# EasyEDA Pro project 15P1D_EDA.eprj, board PCB_1
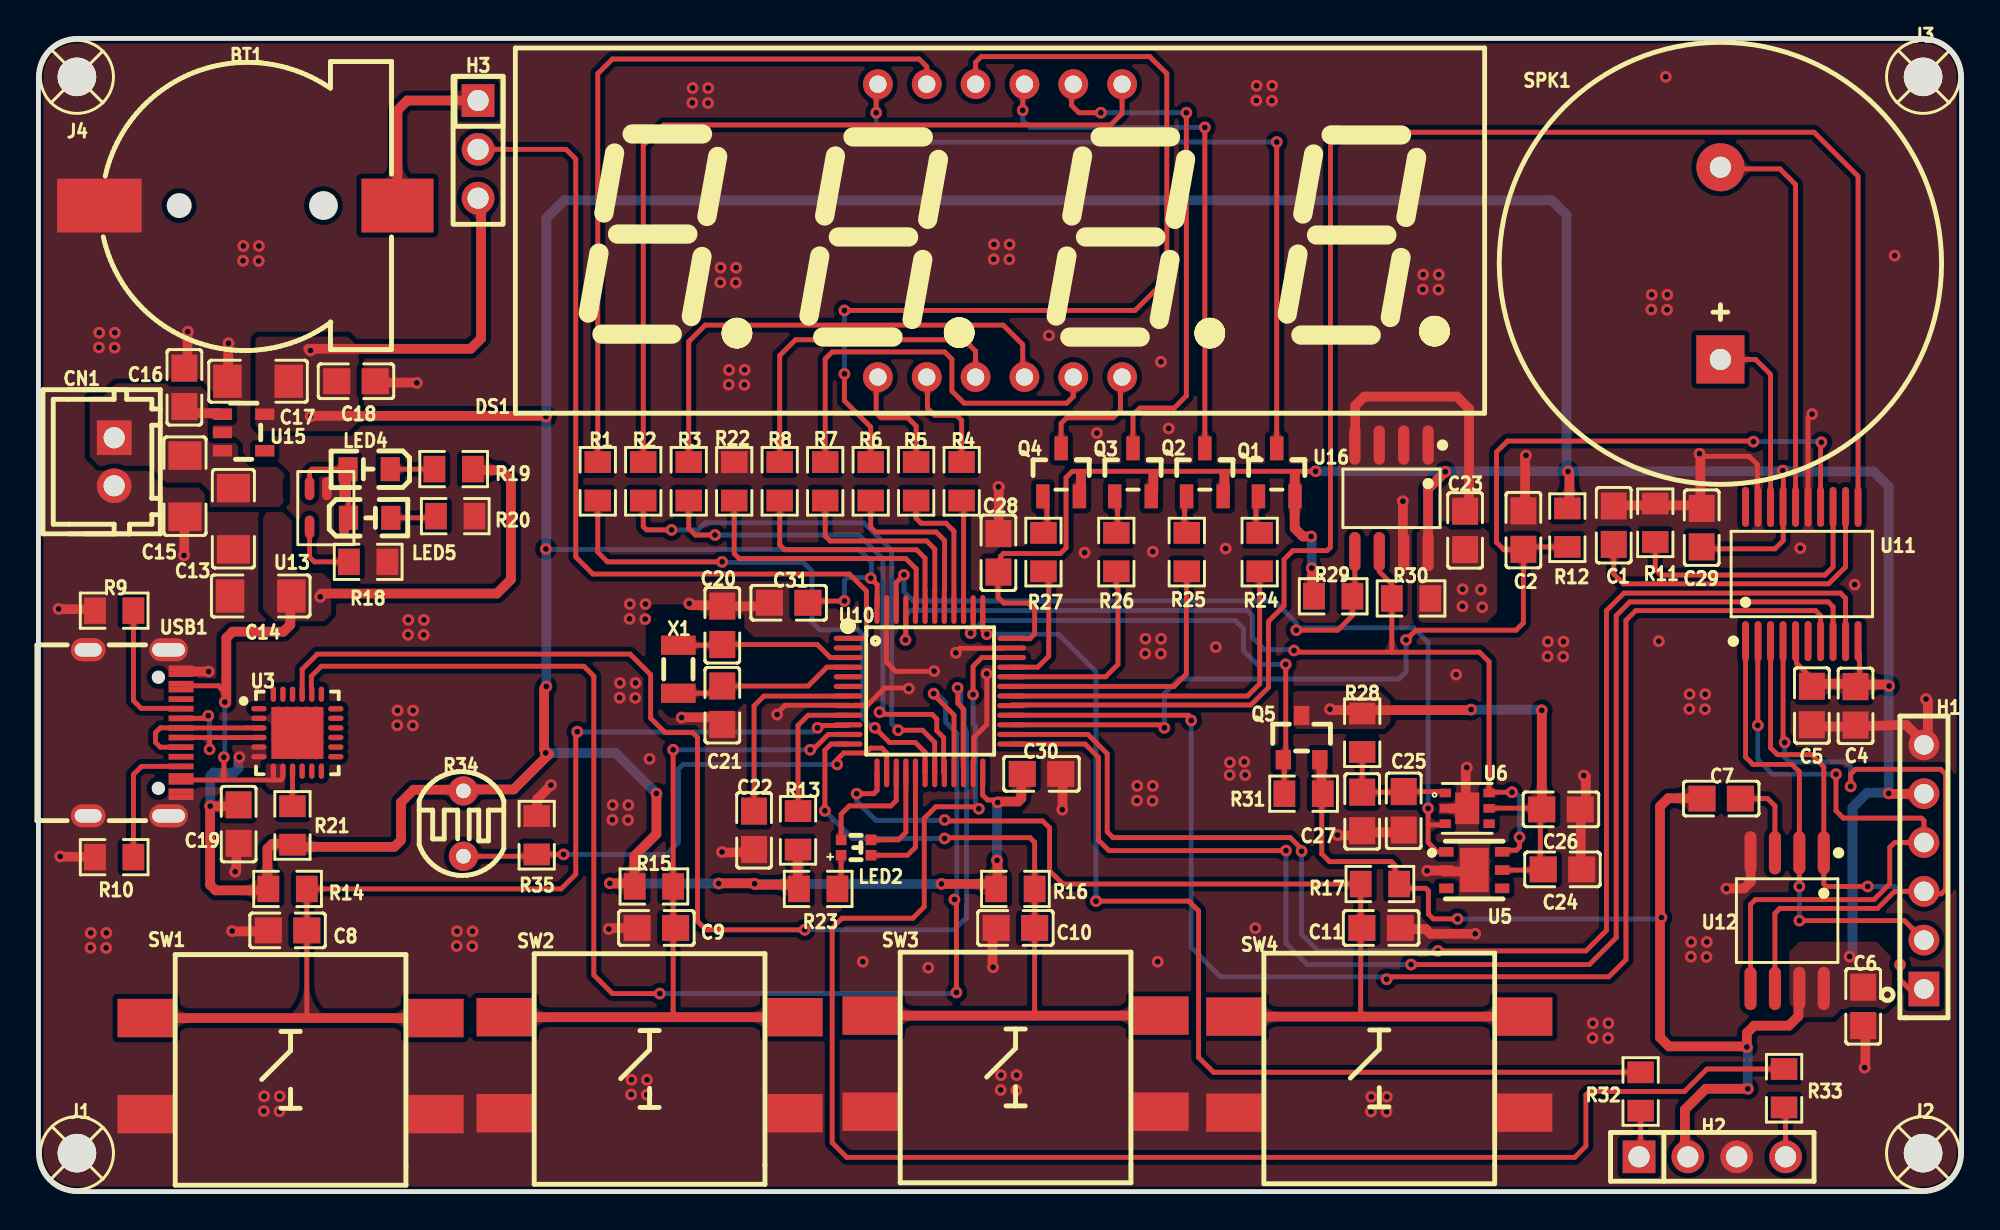
[diagram p4: board, top side]
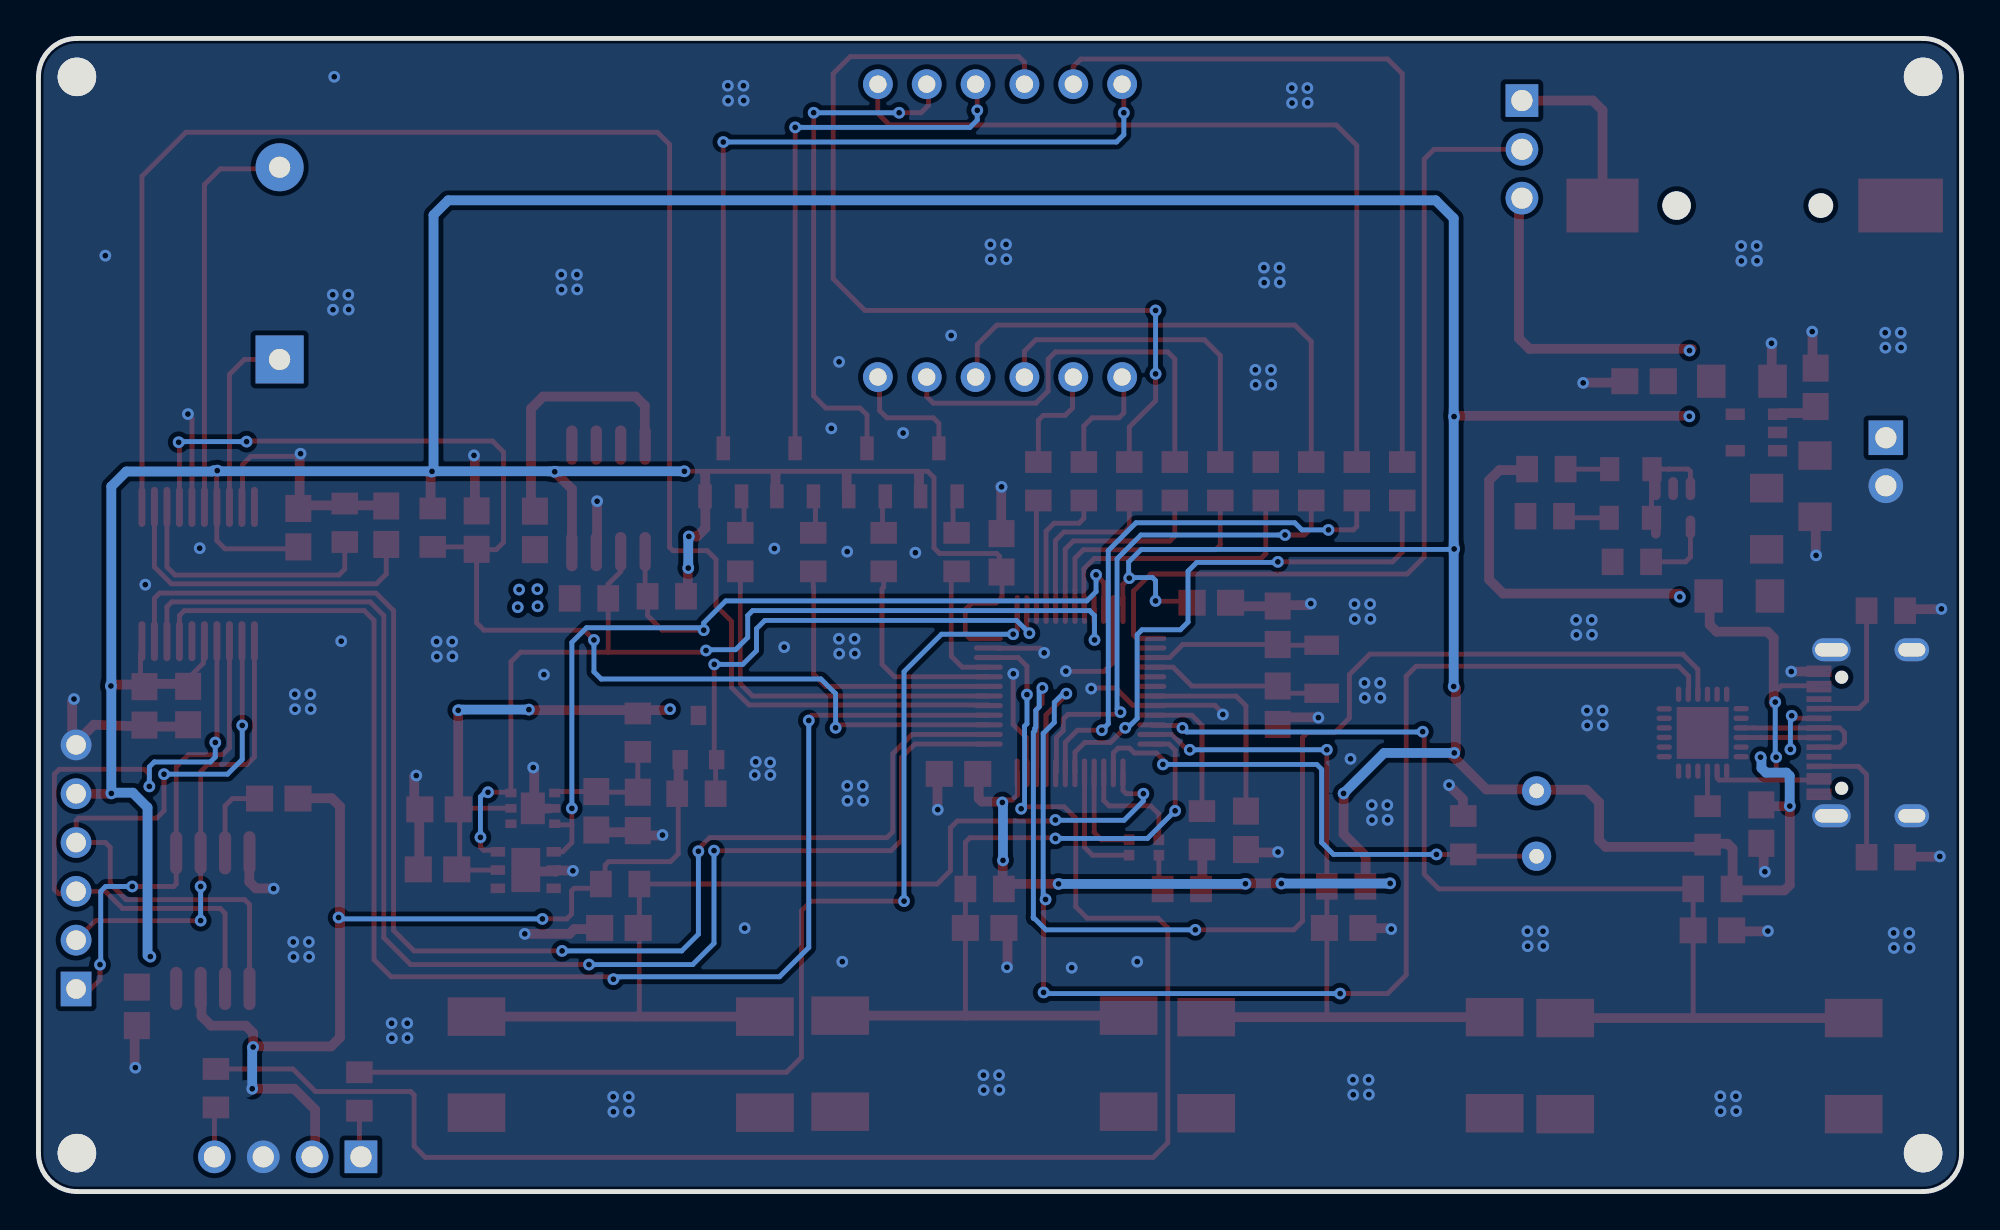
[diagram p5: board, bottom side, seen from below]

Outline 100 x 60 mm; copper layers: Top Layer, Bottom Layer. Coordinates in mm from the lower left corner of the outline.
Outline path: 0,58 0,2 arc(0.59,0.59) 2,0 98,0 arc(99.41,0.59) 100,2 100,58 arc(99.41,59.41) 98,60 2,60 arc(0.59,59.41) 0,58
Stack: Top Layer 0.035mm / Dielectric1 1.51mm FR4 er 4.5 / Bottom Layer 0.035mm

## Design rules (mm)
template: 自定义配置
spacing copperThickness1oz (default): track to track 0.203, other pairs 0.178 to 0.203
spacing copperThickness2oz: track to track 0.203, other pairs 0.152 to 0.3
track width copperThickness1oz (default): min 0.254, default 0.254, max 2.54
track width copperThickness2oz: min 0.203, default 0.254, max 2.54
differential pair differentialPair (default): width min 0.127, default 0.254, max 2.54; gap min 0.152, default 0.152
via viaSize (default): diameter min 0.61, default 0.61, max 0.635; hole min 0.305, default 0.305, max 0.381

## Placement (name value [footprint] x y rotation side)
BT1  BS-12-B3AA003  [BAT-SMD_BS-12-B3AA011]  10.92 51.31 0 top
C1  100nF  [C0805]  81.91 34.67 90 top
C2  100nF  [C0805]  77.22 34.42 90 top
C4  100nF  [C0805]  94.49 25.27 90 top
C5  100nF  [C0805]  92.22 25.29 90 top
C6  100nF  [C0805]  94.88 9.64 90 top
C7  100nF  [C0805]  87.5 20.45 0 top
C8  100nF  [C0805]  12.95 13.59 180 top
C9  100nF  [C0805]  32.13 13.72 180 top
C10  100nF  [C0805]  50.8 13.72 180 top
C11  100nF  [C0805]  69.82 13.72 0 top
C13  10uF  [C1206]  10.14 35.01 270 top
C14  10uF  [C1206]  11.56 30.99 0 top
C15  10uF  [C1206]  7.62 36.7 90 top
C16  100nF  [C0805]  7.59 41.85 270 top
C17  10uF  [C1206]  11.42 42.16 0 top
C18  100nF  [C0805]  16.51 42.16 180 top
C19  10uF  [C0805]  10.41 19.12 90 top
C20  10pF  [C0805]  35.56 29.46 270 top
C21  10pF  [C0805]  35.56 25.31 90 top
C22  100nF  [C0805]  37.21 18.8 90 top
C23  100nF  [C0805]  74.18 34.4 90 top
C24  100nF  [C0805]  79.25 16.76 180 top
C25  1uF  [C0805]  70.99 19.81 90 top
C26  1uF  [C0805]  79.17 19.89 180 top
C27  100nF  [C0805]  68.83 19.78 90 top
C28  100nF  [C0805]  49.92 33.24 90 top
C29  100nF  [C0805]  86.49 34.54 270 top
C30  100nF  [C0805]  52.16 21.73 0 top
C31  100nF  [C0805]  39.01 30.64 0 top
CN1  ZX-XH2.54-2PZZ  [CONN-TH_2P-P2.50_HX25003-2A]  3.94 37.97 270 top
DS1  -  [LED-SEG-TH_FJ5461AH]  50 50 0 top
H1  -  [HDR-TH_6P-P2.54-V-F]  98.04 16.89 90 top
H2  -  [HDR-TH_4P-P2.54-V-F]  87.04 1.81 0 top
H3  Jumper3  [HDR-TH_3P-P2.54-V-M-A]  22.86 54.23 270 top
J1  -  [M2螺丝]  2 2 0 top
J2  -  [M2螺丝]  98 2 0 top
J3  -  [M2螺丝]  98 58 0 top
J4  -  [M2螺丝]  2 58 0 top
LED2  XL-2012RGBC  [LED-SMD_4P-L2.0-W1.3-BR]  42.51 17.9 180 top
LED4  -  [LED_0805]  17.14 37.59 180 top
LED5  -  [LED_0805]  17.27 35.05 0 top
Q1  -  [S8550P_SOT]  64.39 37.47 270 top
Q2  -  [S8550P_SOT]  60.65 37.47 270 top
Q3  -  [S8550P_SOT]  56.92 37.47 270 top
Q4  -  [S8550P_SOT]  53.18 37.47 270 top
Q5  -  [AO3401A_SOT-23-3]  65.68 23.62 270 top
R1  300R  [R0805]  29.08 36.96 90 top
R2  300R  [R0805]  31.45 36.96 90 top
R3  300R  [R0805]  33.81 36.96 90 top
R4  300R  [R0805]  48.01 36.96 90 top
R5  300R  [R0805]  45.64 36.96 90 top
R6  300R  [R0805]  43.28 36.96 90 top
R7  300R  [R0805]  40.91 36.96 90 top
R8  300R  [R0805]  38.54 36.96 90 top
R9  5.1K  [R0805]  3.94 30.23 0 top
R10  5.1K  [R0805]  3.94 17.4 0 top
R11  300K  [R0805]  84.07 34.8 90 top
R12  10K  [R0805]  79.5 34.54 90 top
R13  0R  [R0805]  39.5 18.8 90 top
R14  10K  [R0805]  12.95 15.75 0 top
R15  10K  [R0805]  32 15.88 0 top
R16  10K  [R0805]  50.8 15.75 0 top
R17  10K  [R0805]  69.75 16 180 top
R18  2K  [R0805]  17.14 32.77 180 top
R19  510R  [R0805]  21.59 37.59 180 top
R20  510R  [R0805]  21.67 35.14 180 top
R21  5.1K  [R0805]  13.21 19.05 270 top
R22  10K  [R0805]  36.18 36.96 90 top
R23  510R  [R0805]  40.54 15.75 180 top
R24  2K  [R0805]  63.5 33.27 90 top
R25  2K  [R0805]  59.71 33.27 90 top
R26  2K  [R0805]  56.05 33.27 90 top
R27  2K  [R0805]  52.26 33.27 90 top
R28  4R7  [R0805]  68.83 23.88 270 top
R29  10K  [R0805]  67.33 30.97 180 top
R30  10K  [R0805]  71.37 30.86 0 top
R31  10K  [R0805]  65.79 20.7 180 top
R32  0R  [R0805]  83.31 5.21 270 top
R33  0R  [R0805]  90.77 5.38 270 top
R34  GL5528  [RES-TH_L5.1-W4.3-P3.40-D0.5]  22.1 19.15 0 top
R35  5.1K  [R0805]  25.91 18.54 90 top
SPK1  GSPK2308P-8R0.5W  [SPK-TH_BD23.0-P10.00-D0.8-L-RD]  87.46 48.3 90 top
SW1  -  [Key_SMD_12x12x7.3]  13.11 6.53 180 top
SW2  -  [Key_SMD_12x12x7.3]  31.78 6.57 180 top
SW3  -  [Key_SMD_12x12x7.3]  50.81 6.66 180 top
SW4  -  [Key_SMD_12x12x7.3]  69.72 6.6 180 top
U3  CP2102N-A02-GQFN24R  [QFN-24_L4.0-W4.0-P0.50-TL-EP2.6]  13.46 23.88 0 top
U5  SHT20-TR-1.5KS  [DFN-6_L3.0-W3.0-P0.95-TR-EP]  74.66 16.73 90 top
U6  SGP40-D-R4  [DFN-6_L2.4-W2.4-P0.80-TL-EP]  74.29 19.94 0 top
U10  GD32F303CBT6  [LQFP-48_L7.0-W7.0-P0.50-LS9.0-BL]  46.35 26.03 270 top
U11  WT588D-20SS  [SSOP-20_L7.2-W5.3-P0.65-LS7.8-BL]  91.69 32.13 0 top
U12  W25Q32JVSSIQ  [SOIC-8_L5.3-W5.3-P1.27-LS8.0-BL]  90.93 14.1 180 top
U13  -  [SOP_BCON]  14.1 36.58 270 top
U15  SL6206-33MR  [SOT-23-5_L2.9-W1.6-P0.95-LS2.8-BL]  10.67 39.5 270 top
U16  M24C02-WMN6TP  [SOIC-8_L4.9-W3.9-P1.27-LS6.0-BL]  70.36 36.07 180 top
USB1  -  [USB_TYPE-C-16P]  5 24 270 top
X1  32.768kHz  [FC-135R_L3.2-W1.5]  33.27 27.18 270 top

## Footprints (pads in the part's own frame, mm; a bottom-side part is the same pattern mirrored in y, then rotated)
AO3401A_SOT-23-3
  rect 1x0.8 smd: 1(1.15,-0.95) 2(1.15,0.95) 3(-1.15,0)
BAT-SMD_BS-12-B3AA011
  rect 3.75x2.8 smd: 1(7.75,0)
  rect 4.4x2.8 smd: 2(-7.75,0)
C0805
  rect 1.41x1.35 smd: 1(-1,0) 2(1,0)
C1206
  rect 1.485x1.728 smd: 1(-1.593,0) 2(1.593,0)
CONN-TH_2P-P2.50_HX25003-2A
  rect 1.8x1.8 hole 1.1: 1(-1.25,0)
  round 1.8 hole 1.1: 2(1.25,0)
DFN-6_L2.4-W2.4-P0.80-TL-EP
  rect 0.585x0.448 smd: 1(-1.137,0.8) 2(-1.137,0) 3(-1.137,-0.8) 4(1.137,-0.8) 5(1.137,0) 6(1.137,0.8)
  rect 1.25x1.65 smd: 7(0,0)
DFN-6_L3.0-W3.0-P0.95-TR-EP
  rect 0.5x0.75 smd: 1(0.95,1.452) 2(0,1.451) 3(-0.95,1.45) 4(-0.95,-1.452) 5(0,-1.452) 6(0.95,-1.451)
  rect 2.3x1.5 smd: 7(0.004,-0.001)
FC-135R_L3.2-W1.5
  rect 1x1.8 smd: 1(-1.25,0) 2(1.25,0)
HDR-TH_3P-P2.54-V-M-A
  rect 1.7x1.7 hole 1.1: 1(-2.54,0)
  round 1.7 hole 1.1: 2(0,0) 3(2.54,0)
HDR-TH_4P-P2.54-V-F
  rect 1.7x1.7 hole 1.1: 1(-3.81,0)
  round 1.7 hole 1.1: 2(-1.27,0) 3(1.27,0) 4(3.81,0)
HDR-TH_6P-P2.54-V-F
  rect 1.8x1.6 hole 1.02: 1(-6.35,0)
  round 1.6 hole 1.02: 2(-3.81,0) 3(-1.27,0) 4(1.27,0) 5(3.81,0) 6(6.35,0)
Key_SMD_12x12x7.3
  rect 2.999x1.999 smd: 1(-7.5,-2.499) 2(7.5,-2.499) 3(7.5,2.499) 4(-7.5,2.499)
LED-SEG-TH_FJ5461AH
  round 1.55 hole 0.9: 1(-6.35,-7.62) 2(-3.81,-7.62) 3(-1.27,-7.62) 4(1.27,-7.62) 5(3.81,-7.62) 6(6.35,-7.62) 7(6.35,7.62) 8(3.81,7.62) 9(1.27,7.62) 10(-1.27,7.62) 11(-3.81,7.62) 12(-6.35,7.62)
LED-SMD_4P-L2.0-W1.3-BR
  rect 0.55x0.55 smd: 1(0.775,-0.4) 2(-0.775,-0.4) 3(0.775,0.4) 4(-0.775,0.4)
LED_0805
  rect 1x1.25 smd: 1(-1.15,0.005) 2(1.05,0.005)
LQFP-48_L7.0-W7.0-P0.50-LS9.0-BL
  oval 0.27x1.5 smd: 1(-2.75,-4.25) 2(-2.25,-4.25) 3(-1.75,-4.25) 4(-1.25,-4.25) 5(-0.75,-4.25) 6(-0.25,-4.25) 7(0.25,-4.25) 8(0.75,-4.25) 9(1.25,-4.25) 10(1.75,-4.25) 11(2.25,-4.25) 12(2.75,-4.25) 25(2.75,4.25) 26(2.25,4.25) 27(1.75,4.25) 28(1.25,4.25) 29(0.75,4.25) 30(0.25,4.25) 31(-0.25,4.25) 32(-0.75,4.25) 33(-1.25,4.25) 34(-1.75,4.25) 35(-2.25,4.25) 36(-2.75,4.25)
  oval 1.5x0.27 smd: 13(4.25,-2.75) 14(4.25,-2.25) 15(4.25,-1.75) 16(4.25,-1.25) 17(4.25,-0.75) 18(4.25,-0.25) 19(4.25,0.25) 20(4.25,0.75) 21(4.25,1.25) 22(4.25,1.75) 23(4.25,2.25) 24(4.25,2.75) 37(-4.25,2.75) 38(-4.25,2.25) 39(-4.25,1.75) 40(-4.25,1.25) 41(-4.25,0.75) 42(-4.25,0.25) 43(-4.25,-0.25) 44(-4.25,-0.75) 45(-4.25,-1.25) 46(-4.25,-1.75) 47(-4.25,-2.25) 48(-4.25,-2.75)
M2螺丝
  round 2 hole 2: 1(0,0)
QFN-24_L4.0-W4.0-P0.50-TL-EP2.6
  oval 0.8x0.28 smd: 1(-2,1.25) 2(-2,0.75) 3(-2,0.25) 4(-2,-0.25) 5(-2,-0.75) 6(-2,-1.25) 13(2,-1.25) 14(2,-0.75) 15(2,-0.25) 16(2,0.25) 17(2,0.75) 18(2,1.242)
  oval 0.28x0.8 smd: 7(-1.25,-2) 8(-0.75,-2) 9(-0.25,-2) 10(0.25,-2) 11(0.75,-2) 12(1.25,-2) 19(1.25,2) 20(0.75,2) 21(0.25,2) 22(-0.25,2) 23(-0.75,2) 24(-1.25,2)
  rect 2.7x2.7 smd: 25(0,-0.013)
R0805
  rect 1.133x1.377 smd: 1(-1,0) 2(1,0)
RES-TH_L5.1-W4.3-P3.40-D0.5
  round 1.524 hole 0.762: 1(0,1.7) 2(0,-1.7)
S8550P_SOT
  rect 1.25x0.701 smd: 1(1.292,-0.95) 2(1.292,0.95) 3(-1.208,0)
SOIC-8_L4.9-W3.9-P1.27-LS6.0-BL
  oval 0.588x2.045 smd: 1(-1.905,-2.772) 2(-0.635,-2.772) 3(0.635,-2.772) 4(1.905,-2.772) 5(1.905,2.772) 6(0.635,2.772) 7(-0.635,2.772) 8(-1.905,2.772)
SOIC-8_L5.3-W5.3-P1.27-LS8.0-BL
  oval 0.63x2.25 smd: 1(-1.905,-3.53) 2(-0.635,-3.53) 3(0.635,-3.53) 4(1.905,-3.53) 5(1.905,3.53) 6(0.635,3.53) 7(-0.635,3.53) 8(-1.905,3.53)
SOP_BCON
  oval 1.2x0.5 smd: 1(0,1.8) 2(0,0.9) 3(0,0) 4(2,0) 5(2,1.8)
SOT-23-5_L2.9-W1.6-P0.95-LS2.8-BL
  rect 0.6x1 smd: 1(-0.95,-1.1) 2(0,-1.1) 3(0.95,-1.1) 4(0.95,1.1) 5(-0.95,1.1)
SPK-TH_BD23.0-P10.00-D0.8-L-RD
  rect 2.5x2.5 hole 1.1: 1(-5,0)
  round 2.5 hole 1.1: 2(5,0)
SSOP-20_L7.2-W5.3-P0.65-LS7.8-BL
  oval 0.364x2.082 smd: 1(-2.925,-3.491) 2(-2.275,-3.491) 3(-1.625,-3.491) 4(-0.975,-3.491) 5(-0.325,-3.491) 6(0.325,-3.491) 7(0.975,-3.491) 8(1.625,-3.491) 9(2.275,-3.491) 10(2.925,-3.491) 11(2.925,3.491) 12(2.275,3.491) 13(1.625,3.491) 14(0.975,3.491) 15(0.325,3.491) 16(-0.325,3.491) 17(-0.975,3.491) 18(-1.625,3.491) 19(-2.275,3.491) 20(-2.925,3.491)
USB_TYPE-C-16P
  oval 1.2x2 hole 0.7x1.7: 1(-4.193,1.765) 2(4.447,1.765)
  oval 1.2x1.8 hole 0.7x1.4: 3(-4.193,-2.415) 4(4.447,-2.415)
  rect 0.3x1.3 smd: A1(-3.223,2.415) A4(-2.423,2.415) A5(-1.123,2.415) A6(-0.123,2.415) A7(0.377,2.415) A8(1.377,2.415) A9(2.677,2.415) A12(3.477,2.415) B1(3.177,2.415) B4(2.377,2.415) B5(1.877,2.415) B6(0.877,2.415) B7(-0.623,2.415) B8(-1.623,2.415) B9(-2.123,2.415) B12(-2.923,2.415)

## Nets
As in the schematic.

Pads without a net: U3 1 10 11 12 13 14 15 16 17 18 19 22 23 24; U5 3 4; U6 4; U10 2 5 6; U11 6 20; U15 4; USB1 A8 B8

## Via types
v1: diameter 0.61, hole 0.305, Top Layer to Bottom Layer, 264 vias

## Routing (per net, layer and track width the routed paths; a pad name or vN(x,y) marks a point on that pad's centre or on a via; arc(x,y) is an arc through that point)
+3V3: length 392.1
  Top Layer w0.254: 70.53,16.26 70.53,16.98 70.35,17.17 67.14,17.17 66.73,17.57 66.73,20.46 ; 50.03,32.71 50.03,33.05 50.18,33.2 53.14,33.2 53.43,33.49 53.43,37.15 53.76,37.48 v1(66.41,37.48) ; 90.7,35.95 90.74,35.98 90.74,37.42 ; v1(73.79,14.19) 72.53,14.19 72.28,14.44 72.28,15.64 72.14,15.78 71.04,15.78 ; C28.1 49.9,32.21 49.9,30.92 50.2,30.62 51.46,30.62 51.8,30.28 51.8,29.01 51.56,28.77 51.15,28.77 ; 86.63,33.44 90.3,33.44 90.73,33.87 90.73,34.9 90.68,34.95 ; 94.69,27.99 94.69,26.69 ; 91.42,28.66 91.42,27.49 92.12,26.79 92.12,26.69 ; 40.15,30.72 41.9,30.72 v1(41.91,30.73) ; 43.61,30.52 43.61,31.58 v1(43.28,31.92) ; 49.09,21.77 49.09,20.64 49.35,20.38 49.88,20.38
  Top Layer w0.508: 88.84,7.46 88.75,7.55 84.79,7.55 84.32,8.02 84.32,20.04 84.75,20.46 85.93,20.46 ; 72.26,33.78 72.26,36.56 v1(73.15,37.45) ; 54.22,37.34 54.21,37.33 54.21,36.49 ; 65.32,35.82 65.32,34.51 65.75,34.09 v1(66.18,34.09) ; v1(35.37,16.03) 35.38,16.04 37.15,16.04 ; v1(49.84,17.23) 49.86,17.21 49.86,16.36 ; 13.65,17.94 18.5,17.94 18.85,18.28 18.85,20.25 19.51,20.91 21.85,20.91 22.04,20.72 ; 26.34,40.3 26.28,40.36 14.14,40.36 ; 61.67,36.29 61.67,37.31 61.66,37.32 ; 92.63,26.42 94.48,26.42 ; 66.71,22.32 66.71,20.96 66.82,20.86 ; 66.23,31.2 66.23,32.42 v1(66.21,32.44) ; 94.46,26.46 94.45,26.45 ; 39.48,17.66 39.48,15.83 39.64,15.67 ; v1(96.21,20.72) 96.24,20.69 97.75,20.69 ; 13,18.1 12.17,18.1 11.91,17.84 11.91,15.99 11.89,15.97 ; 14.03,43.85 22.48,43.85 23.01,44.39 23.01,51.33 22.78,51.57 ; 49.55,15.84 49.38,16.01 v1(46.96,16.01) ; 79.58,35.56 79.61,35.59 79.61,37.35 ; 94.49,26.38 96.16,26.38 96.22,26.32 ; 10.45,20.24 10.26,20.05 8.95,20.05 ; 8.93,20.04 8.93,15.95 9.21,15.67 11.57,15.67 11.61,15.64 ; 65.35,37.32 65.33,37.29 65.33,36.3 ; v1(26.41,26.28) 26.29,26.17 26.29,23 26.54,22.75 ; v1(88.84,7.52) 88.84,8.25 89.22,8.63 91.02,8.63 91.52,9.13 91.52,10.33 ; v1(88.88,5.35) 86.7,5.35 85.61,4.26 85.61,1.94 ; v1(26.38,22.82) 26.45,22.75 26.54,22.75 ; 30.92,15.99 30.87,16.04 29.81,16.04 ; v1(37.24,16.02) 37.28,15.97 39.38,15.97 ; 57.97,36.36 57.97,37.34 ; 51,21.51 51.11,21.41 51.11,20.45 50.95,20.3 50.04,20.3 ; 26.54,22.75 24.71,20.92 22.46,20.92 ; 30.99,15.97 30.99,17.46 32.13,18.6 v1(32.13,20.72) ; v1(49.88,20.25) 49.88,20.25
  Bottom Layer w0.254: v1(41.91,30.73) 41.91,31.79 42.07,31.95 43.18,31.95 43.28,31.85 ; 26.51,33.44 26.54,33.41 42.66,33.41 43.31,32.76 43.31,32.02 ; v1(73.79,14.19) 84.32,14.19 v1(84.39,14.26)
  Bottom Layer w0.508: v1(96.21,20.72) 96.21,36.69 95.43,37.47 90.96,37.47 90.88,37.54 ; v1(29.71,16.04) 29.72,16.03 v1(35.37,16.03) ; v1(26.38,22.82) 30.03,22.82 v1(32.13,20.72) ; v1(66.21,32.44) 66.21,34.06 v1(66.18,34.09) ; v1(49.88,20.25) 49.84,20.21 v1(49.84,17.23) ; 8.94,20.06 8.94,21.63 9.11,21.8 10.17,21.8 10.4,22.03 10.4,22.55 10.44,22.59 ; 96.06,20.74 96.05,20.75 95.1,20.75 94.33,19.99 94.33,12.27 ; v1(37.24,16.02) 37.24,16.01 v1(46.96,16.01) ; 79.57,37.48 90.67,37.48 ; v1(66.41,37.48) 79.52,37.48 ; 79.52,37.48 79.57,37.42 ; 79.52,37.48 79.46,37.54 79.46,50.81 78.69,51.58 27.34,51.58 26.41,50.64 v1(26.41,26.28) ; v1(88.84,7.52) 88.88,7.47 v1(88.88,5.35)
  vias: v1(8.93,20.06) v1(10.45,22.6) v1(14.15,43.76) v1(14.15,40.34) v1(26.39,40.33) v1(26.39,33.44) v1(74.05,30.45) v1(74.06,31.34) v1(75.01,31.32) v1(75.08,30.41) v1(79.54,37.47) v1(90.7,37.51) v1(94.18,12.22) v1(96.23,26.31)
GND: length 118.4
  Top Layer w0.254: 46.5,27.07 44.58,27.07 44.1,27.55 44.1,30.23 ; 86.5,38.4 86.64,38.25 88.96,38.25 89.39,37.82 89.39,35.63 ; 50.19,28.27 47.92,28.27 47.7,28.06 ; 42.17,25.31 38.83,25.31 38.41,24.89 ; 42.4,25.31 43.1,25.31 44,26.2 45.28,26.2 ; 48.64,22.36 48.64,23.63 49.32,24.31 49.32,26.94 ; 92.22,40.43 92.02,40.23 92.02,34.98
  Top Layer w0.508: 1.12,17.41 1.13,17.42 2.89,17.42 ; 94.98,6.42 95,6.44 95,8.76 ; 73,16.7 72.22,16.7 v1(72.21,16.69) ; 97.96,23.44 97.12,24.29 94.53,24.19 ; 73,16.73 73.07,16.66 73.12,16.66 ; 91.95,24.34 92.09,24.19 94.53,24.19 ; 37.31,17.64 35.59,17.64 35.58,17.66 ; 1.04,30.29 1.05,30.3 2.81,30.3 ; 68.47,38.67 68.47,40.89 68.95,41.37 73.76,41.37 74.39,40.73 74.39,35.97 74.22,35.8 ; 80.2,19.72 80.2,17.06 80.08,16.94 ; 35.6,30.51 33.95,30.51 33.89,30.57 ; 86.42,35.81 86.42,38.27 ; 26.66,21.15 25.93,20.42 25.93,19.43 ; 73.43,19.93 74.22,19.93 ; 7.75,42.99 7.75,44.75 7.74,44.75 ; 7.34,27.06 8.85,27.06 ; 35.53,24.23 35.09,24.68 33.53,24.68 ; 98.25,23 98.25,25.51 98.14,25.62 ; 86.4,38.3 86.35,38.35 ; 89.04,17.47 89.04,16.11 88.69,15.77 87.84,15.77 ; 67.61,18.57 67.66,18.53 68.56,18.53 ; 77.31,35.68 77.31,38.19 77.37,38.25 ; 35.99,30.45 37.73,30.45 37.84,30.56 ; v1(74.71,13.41) 72.39,13.41 72.14,13.66 71.07,13.66 ; 10.06,13.53 10.07,13.54 11.83,13.54 ; 53.25,21.63 53.25,19.87 53.26,19.86 ; 19.68,42.1 19.68,42.09 17.92,42.09 ; 73.12,16.65 73.12,16.66 ; 73.12,16.66 74.73,16.66 ; 70.95,33.8 70.95,35.87 70.89,35.93 ; 74.51,19.93 74.52,19.94 ; 9.87,42.38 9.87,44.14 9.86,44.15 ; 49.61,13.64 49.61,11.65 49.62,11.64 ; 81.9,35.7 86.34,35.7 86.48,35.56 ; 50.01,36.67 49.94,36.6 49.94,34.82 ; 10.27,16.72 10.29,16.74 10.29,17.66 ; 70.87,18.69 69.08,18.69 69.02,18.63 ; 30.82,13.87 30.65,13.7 29.65,13.7 ; 7.58,34.86 7.58,33.1 7.59,33.09 ; 74.22,19.99 74.22,22.01 74.26,22.05 ; 80.46,20.02 80.46,21.61 80.38,21.69 ; 7.64,42.92 7.64,42.93 ; 94.53,24.19 94.62,24.19
  vias: v1(1.05,30.32) v1(1.13,17.44) v1(2.72,13.46) v1(2.7,12.69) v1(3.14,43.92) v1(3.16,44.69) v1(3.53,13.46) v1(3.52,12.68) v1(3.97,44.69) v1(3.96,43.91) v1(7.56,33.1) v1(7.77,44.75) v1(8.85,27.06) v1(9.88,44.14) v1(10.07,13.56) v1(10.23,16.64) v1(10.64,48.43) v1(10.65,49.2) v1(11.46,49.2) v1(11.45,48.42) v1(11.73,4.96) v1(11.72,4.19) v1(12.55,4.96) v1(12.53,4.18) v1(18.67,25.03) v1(18.65,24.26) v1(19.23,29.74) v1(19.22,28.97) v1(19.48,25.03) v1(19.47,24.25) v1(19.68,42.08) v1(20.04,29.74) v1(20.03,28.97) v1(21.75,12.78) v1(21.76,13.55) v1(22.57,13.55) v1(22.56,12.77) v1(26.65,21.15) v1(29.66,13.66) v1(29.84,19.34) v1(29.86,20.11) v1(30.24,26.47) v1(30.22,25.7) v1(30.74,29.8) v1(30.67,20.11) v1(30.66,19.33) v1(30.75,30.57) v1(30.83,5.82) v1(30.82,5.05) v1(31.05,26.47) v1(31.03,25.69) v1(31.56,30.57) v1(31.55,29.79) v1(31.65,5.82) v1(31.63,5.04) v1(31.77,22.51) v1(33.44,24.66) v1(33.84,30.6) v1(34.02,57.42) v1(34,56.65) v1(34.83,57.42) v1(34.81,56.64) v1(35.47,48.07) v1(35.45,47.3) v1(35.54,17.67) v1(35.91,42.76) v1(35.89,41.99) v1(36.28,48.07) v1(36.26,47.29) v1(36.72,42.76) v1(36.71,41.98) v1(38.41,24.82) v1(42.87,11.96) v1(45.26,26.17) v1(46.27,11.65) v1(46.57,27.08) v1(47.7,28.03) v1(49.31,26.94) v1(49.64,11.67) v1(49.69,49.28) v1(49.67,48.51) v1(49.92,36.67) v1(50.05,6.06) v1(50.03,5.29) v1(50.5,49.28) v1(50.48,48.5) v1(50.85,5.28) v1(50.86,6.06) v1(52.54,44.54) v1(53.24,19.87) v1(54.4,33.24) v1(55.04,39.47) v1(57.13,21.11) v1(57.12,20.34) v1(57.55,27.99) v1(57.56,28.76) v1(57.95,33.3) v1(57.95,21.11) v1(57.93,20.33) v1(58.2,11.96) v1(58.37,43.17) v1(58.38,28.76) v1(58.36,27.98) v1(58.77,39.71) v1(61.22,28.33) v1(61.73,33.46) v1(61.94,21.67) v1(61.95,22.33) v1(62.7,22.36) v1(62.75,21.67) v1(63.34,57.54) v1(63.33,56.77) v1(63.28,13.71) v1(64.14,56.76) v1(64.15,57.54) v1(67.55,18.55) v1(69.3,4.93) v1(69.29,4.16) v1(70.12,4.93) v1(70.1,4.15) v1(70.95,35.92) v1(72,47.71) v1(71.99,46.94) v1(72.81,47.71) v1(72.8,46.93) v1(73.72,26.9) v1(74.27,22.06) v1(77.35,38.31) v1(78.49,28.62) v1(78.47,27.85) v1(79.3,28.62) v1(79.29,27.84) v1(80.35,21.64) v1(80.82,8.76) v1(80.81,7.99) v1(81.64,8.76) v1(81.62,7.98) v1(83.89,46.66) v1(83.87,45.89) v1(84.26,28.64) v1(84.62,58) v1(84.7,46.66) v1(84.68,45.88) v1(85.84,25.11) v1(85.86,25.88) v1(85.94,12.99) v1(85.93,12.22) v1(86.37,38.39) v1(86.67,25.88) v1(86.66,25.1) v1(86.74,12.21) v1(86.75,12.99) v1(87.77,15.76) v1(91.62,33.48) v1(92.23,40.46) v1(94.44,31.58) v1(94.96,6.45) v1(96.52,48.7) v1(98.15,25.63)
VBAT: length 1.8
  Top Layer w0.508: 7.67,40.59 7.75,40.5 9.44,40.5
VBUS: length 37.4
  Top Layer w0.254: 7.59,26.3 7.61,26.32 9.36,26.32 9.69,25.99 ; 7.5,21.41 12.61,21.41 12.71,21.51 ; v1(9.64,22.6) 9.64,21.44 9.62,21.42
  Top Layer w0.508: 14.7,31.12 23.84,31.12 24.57,31.85 24.57,37 24.03,37.54 22.52,37.54 ; 9.77,25.41 9.77,28.81 10.09,29.13 12.74,29.13 13.09,29.49 13.09,30.65 13.17,30.72
  Bottom Layer w0.254: v1(9.64,22.6) 9.69,22.65 v1(9.69,25.47)
  vias: v1(14.65,30.94)
+VS: length 23.4
  Top Layer w0.254: 77.95,19.87 77.87,19.95 75.56,19.95 ; 78.1,16.89 78.1,19.65 ; 78.28,16.73 78.33,16.68 ; 76.2,16.73 78.1,16.73
  Top Layer w0.508: v1(78.17,25.04) 78.17,19.89 78.26,19.8 ; 67.19,25.05 74.47,25.05 v1(74.5,25.08)
  Bottom Layer w0.508: v1(74.5,25.08) 78.14,25.08 v1(78.17,25.04)
  vias: v1(67.16,25.1)
AM_BUSY: length 90.2
  Top Layer w0.254: U10.29 50.64,25.32 63.05,25.32 63.96,26.23 63.96,29.67 64.77,30.48 64.77,32.89 65.23,33.35 67,33.35 67.18,33.53 67.18,54.48 67.82,55.12 92.33,55.12 94.62,52.83 U11.11
AM_CLK: length 72.9
  Top Layer w0.254: v1(72.77,12.52) 80.47,12.52 81.53,13.59 81.53,30.23 82.45,31.14 93.7,31.14 93.97,30.87 U11.9 ; v1(65.68,17.71) 65.74,17.77 65.09,18.42 55.88,18.42 55.57,18.72 55.57,22.78 54.57,23.78 U10.26
  Bottom Layer w0.254: v1(65.68,17.71) 65.68,13.39 66.55,12.52 v1(72.77,12.52)
AM_CS: length 72.3
  Top Layer w0.254: v1(64.87,17.74) 55.67,17.74 55.12,18.29 55.12,22.59 54.43,23.28 U10.25 ; U11.8 93.32,30.43 93.06,30.68 82.75,30.68 82.04,29.97 82.04,13.21 80.65,11.81 v1(71.37,11.81)
  Bottom Layer w0.254: v1(71.37,11.81) 65.98,11.81 64.87,12.92 v1(64.87,17.74)
AM_DAT: length 74.5
  Top Layer w0.254: U11.7 92.67,29.97 92.41,30.23 83.06,30.23 82.55,29.72 82.55,12.06 81.66,11.18 70.23,11.18 v1(70.1,11.05) ; v1(59.94,24.51) 59.94,24.64 59.8,24.78 U10.28
  Bottom Layer w0.254: v1(59.94,24.51) 59.94,12.7 61.47,11.18 69.98,11.18 v1(70.1,11.05)
AM_RST: length 63.9
  Top Layer w0.254: v1(71.12,28.7) 71.62,29.21 76.84,29.21 77.22,29.59 C2.1 ; U11.14 92.67,38.95 v1(92.71,38.99) ; C2.1 77.34,33.54 R12.1 ; C2.1 77.2,33.4 76.2,33.4 75.82,33.78 75.82,38.48 76.39,39.05 89.15,39.05 v1(89.18,39.02) ; v1(58.55,24.13) 58.39,24.28 U10.27
  Bottom Layer w0.254: v1(89.18,39.02) 92.68,39.02 v1(92.71,38.99) ; v1(58.55,24.13) 58.55,25.91 59.31,26.67 70.74,26.67 71.12,27.05 v1(71.12,28.7)
COM1: length 19
  Top Layer w0.254: U10.30 62.87,25.78 63.5,26.42 R24.1
COM2: length 14.7
  Top Layer w0.254: U10.31 59.05,26.28 59.69,26.92 59.69,31.43 59.71,31.45 R25.1
COM3: length 10.7
  Top Layer w0.254: U10.32 55.49,26.78 56.13,27.43 56.13,31.37 56.05,31.45 R26.1
COM4: length 6.7
  Top Layer w0.254: U10.33 51.96,27.28 52.53,27.86 52.53,32 R27.1
I2C_SCL: length 52.5
  Top Layer w0.254: 75.43,20.8 75.43,27.56 74.93,28.07 70.37,28.07 ; 70.37,28.07 70.37,28.07 R30.1 70.37,31.61 69.72,32.26 U16.6 ; 70.37,28.07 65.37,28.07 v1(65.29,28.15) ; U10.45 45.1,28.72 v1(45.09,28.7) ; v1(77.02,18.43) 77.02,17.93 76.85,17.76 76.25,17.76 ; 75.39,20.8 75.41,20.78 v1(76.62,20.78)
  Bottom Layer w0.254: v1(65.29,28.15) 65.25,28.19 63.75,28.19 63.12,28.83 63.12,29.97 62.87,30.23 45.34,30.23 45.09,29.97 v1(45.09,28.7) ; v1(76.62,20.78) 76.78,20.78 77.02,20.54 v1(77.02,18.43)
I2C_SDA: length 50.6
  Top Layer w0.254: v1(45,32.09) 44.6,31.69 U10.46 ; v1(65.41,29.21) 67.56,29.21 68.33,29.97 R29.1 68.45,31.1 U16.5 ; U6.3 73.1,19.08 72.26,19.08 ; 72.26,19.08 72.26,18.16 72.75,17.68 U5.1 ; 72.26,19.08 v1(72.26,19.94)
  Bottom Layer w0.254: v1(45,32.09) 45,31.22 45.49,30.73 64.26,30.73 65.41,29.59 v1(65.41,29.21) 65.53,29.34 71.5,29.34 72.26,28.58 v1(72.26,19.94)
KEY1: length 57.8
  Top Layer w0.254: v1(28.02,23.93) 28.02,23.83 27.94,23.75 27.94,16.51 27.18,15.75 R14.2 C8.1 13.95,9.1 14.03,9.03 ; v1(40.51,24.13) 40.63,24.25 42.07,24.25 U10.10
  Top Layer w0.508: 5.61,9.03 20.61,9.03
  Bottom Layer w0.254: v1(28.02,23.93) 28.03,23.91 40.3,23.91 v1(40.51,24.13)
KEY2: length 38.4
  Top Layer w0.254: U10.11 41.07,23.78 40.27,22.99 v1(40.13,22.99) ; 33.1,9.07 33,9.17 R15.2 v1(33,22.99)
  Top Layer w0.508: SW2.2 SW2.1
  Bottom Layer w0.254: v1(33,22.99) v1(40.13,22.99)
KEY3: length 40.2
  Top Layer w0.254: v1(47.12,18.37) 47.16,18.41 51.56,18.41 51.8,18.18 R16.2 C10.1 51.8,9.25 51.71,9.15 ; U10.12 41.21,23.28 40.89,22.97 v1(40.89,19.81)
  Top Layer w0.508: SW3.1 43.31,9.15
  Bottom Layer w0.254: v1(40.89,19.81) 42.33,18.37 v1(47.12,18.37)
KEY4: length 53.7
  Top Layer w0.254: U10.13 43.6,20.87 43.43,20.7 v1(42.54,20.7) ; 68.92,9.1 68.75,9.26 R17.2 53.27,16 52.58,16.69 52.58,18.92 52.22,19.28 47.17,19.28 v1(47.12,19.33)
  Top Layer w0.508: SW4.2 SW4.1
  Bottom Layer w0.254: v1(47.12,19.33) 47.1,19.32 43.55,19.32 42.54,20.32 v1(42.54,20.7)
LED1: length 5.9
  Top Layer w0.254: LED2.1 41.74,19.64 42.16,20.07 44.32,20.07 44.6,20.35 U10.15
LED2: length 5.1
  Top Layer w0.254: U10.16 45.1,18.69 44.72,18.3 LED2.2
LED3: length 6.4
  Top Layer w0.254: U10.17 45.6,17.92 45.19,17.5 LED2.4
PWR_EN: length 26.4
  Top Layer w0.254: v1(48.47,29.05) 48.6,29.19 U10.38 ; R31.2 64.79,22.42 64.73,22.47 64.86,22.6 v1(64.86,27.43)
  Bottom Layer w0.254: v1(48.47,29.05) 49.14,29.72 62.23,29.72 62.66,29.29 62.66,28.14 63.37,27.43 v1(64.86,27.43)
RES_PHOTO: length 27.9
  Top Layer w0.254: R34.2 25.81,17.45 R35.1 v1(27.31,17.54) ; U10.14 44.1,22.82 43.86,23.07 43.27,23.07 43.01,22.82 41.87,22.82 41.53,22.48 v1(41.53,22.22)
  Bottom Layer w0.254: v1(27.31,17.54) 32.66,17.54 33.27,18.16 33.27,21.97 33.53,22.22 v1(41.53,22.22)
RXD: length 70.6
  Top Layer w0.254: v1(47.63,15.2) 47.73,15.1 v1(47.73,10.36) ; 47.6,24.8 46.55,25.85 v1(46.55,25.91) ; 47.61,24.8 47.61,22.45 ; v1(32.31,10.3) 29.84,10.3 28.88,11.26 28.88,26.82 28.36,27.33 14.71,27.33 14.19,26.82 14.19,26.08
  Bottom Layer w0.254: v1(32.31,10.3) 47.67,10.3 v1(47.73,10.36) ; 46.69,25.94 47.18,25.45 47.18,24.41 47.75,23.84 47.75,15.24
SEGA: length 28.9
  Top Layer w0.254: R1.1 29.08,33.27 29.59,32.77 v1(35.55,32.77) ; v1(43.49,24.13) 44.25,23.37 45.59,23.37 46.1,22.86 46.1,21.79 U10.18
  Bottom Layer w0.254: 35.79,32.74 39.77,32.74 40.22,32.28 40.22,29.63 40.62,29.23 42.61,29.23 42.87,28.98 42.87,24.62 43.38,24.11 43.47,24.11
SEGB: length 28.3
  Top Layer w0.254: v1(32.92,34.43) 32.92,34.43 31.62,34.43 31.45,34.6 R2.1 ; U10.19 46.6,23.37 45.97,24 v1(44.7,24)
  Bottom Layer w0.254: v1(32.92,34.43) 34.3,34.43 34.67,34.8 42.93,34.8 44.37,33.35 44.37,24.34 v1(44.7,24)
SEGC: length 26.3
  Top Layer w0.254: v1(43.73,24.94) 43.85,24.83 46.47,24.83 46.71,24.58 46.71,23.98 47.07,23.62 47.07,21.82 U10.20 ; v1(35.18,34.16) 34.16,34.16 33.81,34.51 R3.1
  Bottom Layer w0.254: v1(43.73,24.94) 43.91,25.12 43.91,32.92 42.67,34.16 v1(35.18,34.16)
SEGD: length 5.7
  Top Layer w0.254: U10.39 48.1,35.86 R4.1
SEGDP: length 12.8
  Top Layer w0.254: R8.1 38.54,33.65 38.8,33.4 45.66,33.4 46.1,32.96 46.1,31.29 46.1,31.29 U10.43
SEGE: length 7.2
  Top Layer w0.254: U10.40 47.6,34.36 47.19,34.78 45.89,34.78 45.64,35.03 R5.1
SEGF: length 9.1
  Top Layer w0.254: U10.41 47.1,31.29 47.12,31.3 47.12,33.88 46.68,34.32 43.53,34.32 43.28,34.57 R6.1
SEGG: length 11
  Top Layer w0.254: R7.1 40.91,34.11 41.16,33.85 46.18,33.85 46.61,33.43 46.61,31.29 46.6,31.29 U10.42
SPI_CS_AM: length 25.1
  Top Layer w0.254: v1(96.8,11.81) 96.8,11.02 97.41,10.41 97.92,10.41 H1.1 ; U11.3 90.07,23.09 90.42,22.73 92.2,22.73 92.84,22.1 U12.1 92.84,16 92.96,15.88 v1(95.12,15.88)
  Bottom Layer w0.254: v1(95.12,15.88) 96.51,15.88 96.76,15.62 96.76,11.84 v1(96.8,11.81)
SPI_MISO: length 23.8
  Top Layer w0.254: v1(91.57,15.88) 91.57,21.84 91.19,22.22 89.15,22.22 88.77,22.61 U11.1 ; v1(91.57,14.1) 97.03,14.1 H1.2
  Bottom Layer w0.254: v1(91.57,15.88) v1(91.57,14.1)
SPI_MOSI: length 34.2
  Top Layer w0.254: v1(93.47,21.72) 93.47,19.81 93.85,19.43 97.92,19.43 98.04,19.3 H1.4 96.52,18.16 96.27,17.91 96.27,16.01 95.44,15.19 89.28,15.19 89.03,14.94 U12.5 ; 89.42,28.64 89.4,28.62 v1(89.4,24.26)
  Bottom Layer w0.254: v1(89.4,24.26) 89.4,22.48 90.17,21.72 v1(93.47,21.72)
SPI_SCK: length 35.9
  Top Layer w0.254: v1(90.81,23.37) 90.72,23.45 U11.4 ; U12.6 90.3,14.48 90.55,14.73 95.63,14.73 96.52,15.62 98.04,15.62 98.17,15.49 98.95,15.49 99.17,15.72 99.17,21.72 98.92,21.97 94.49,21.97 94.23,21.72 v1(94.23,21.08)
  Bottom Layer w0.254: v1(94.23,21.08) 94.23,22.1 93.98,22.35 91.06,22.35 90.81,22.61 v1(90.81,23.37)
TXD: length 65.6
  Top Layer w0.254: 14.48,27.94 13.71,27.17 U3.21 ; 14.48,27.97 30.76,27.97 31.83,26.9 31.83,24.64 32.59,23.88 34.02,23.88 34.27,23.63 34.27,14.07 34.72,13.62 v1(39.84,13.62) ; 48.09,22.09 48.09,25.13 47.81,25.4 47.81,26.05
  Bottom Layer w0.254: 48.27,14.27 48.27,23.9 48.19,23.98 48.19,24.11 48.14,24.15 48.14,25.04 47.96,25.22 47.96,26.04 v1(47.8,26.21) ; 48.27,14.27 48.28,14.29 ; 48.27,14.27 48.27,14.21 ; 48.27,14.27 47.61,13.62 v1(39.84,13.62)
USB_DN: length 8
  Top Layer w0.254: USB1.B7 8.7,24.62 v1(8.83,24.76) ; 9.01,23.62 8.9,23.51 v1(8.9,23.01) ; 9.01,23.62 USB1.A7 ; 9.01,23.62 10.46,23.62 10.46,23.63 U3.4
  Bottom Layer w0.254: v1(8.9,23.01) 8.9,24.69 v1(8.83,24.76)
USB_DP: length 7.4
  Top Layer w0.254: U3.3 10.81,24.13 10.81,24.12 USB1.A6 7.41,24.13 6.34,24.13 6.09,23.88 6.09,23.38 6.34,23.12 USB1.B6
$1N1449: length 26.9
  Top Layer w0.254: Q3.3 56.92,40.41 57.28,40.77 59.06,40.77 59.69,41.4 v1(59.69,56.13) ; v1(55.25,56.13) 54.1,56.13 53.72,56.52 53.72,57.53 DS1.8
  Bottom Layer w0.254: v1(59.69,56.13) v1(55.25,56.13)
$1N1467: length 6.1
  Top Layer w0.254: DS1.1 43.56,42.29 43.56,40.51 43.81,40.26 45.21,40.26 45.64,39.83 R5.2
$1N1471: length 5.8
  Top Layer w0.254: R4.2 48.01,40.13 47.75,40.39 46.61,40.39 46.23,40.77 46.23,42.34 DS1.2
$1N1475: length 17.7
  Top Layer w0.254: DS1.3 48.73,43.73 48.13,44.32 39.37,44.32 38.54,43.5 R8.2
$1N1479: length 26.1
  Top Layer w0.254: R3.2 33.81,44.23 34.67,45.08 50.16,45.08 51.18,44.07 51.18,42.47 DS1.4
$1N1483: length 21.6
  Top Layer w0.254: R7.2 40.91,43.32 41.28,43.69 47.12,43.69 47.5,43.31 47.5,41.66 48.13,41.02 53.47,41.02 53.81,41.36 DS1.5
$1N1487: length 38.7
  Top Layer w0.254: DS1.11 46.19,58.53 45.79,58.93 29.84,58.93 29.08,58.17 R1.2
$1N1491: length 43.6
  Top Layer w0.254: R2.2 31.45,54.44 32.51,55.5 55.75,55.5 56.35,56.1 DS1.7
$1N1495: length 48.1
  Top Layer w0.254: DS1.10 48.73,58.76 49.02,59.06 57.78,59.06 58.67,58.17 58.67,47.5 57.02,45.85 v1(41.91,45.85) ; R6.2 43.28,39.78 41.91,41.15 v1(41.91,42.55)
  Bottom Layer w0.254: v1(41.91,42.55) v1(41.91,45.85)
$1N6161: length 17.3
  Top Layer w0.254: C1.1 81.91,32.13 82.42,31.62 93.09,31.62 93.97,32.5 U11.12
$1N6192: length 14.1
  Top Layer w0.254: U11.13 93.32,32.5 92.9,32.08 84.38,32.08 84.07,32.39 R11.1
$1N6375: length 9.8
  Top Layer w0.254: U11.18 90.07,42.52 89.29,43.3 SPK1.1
$1N6384: length 21.1
  Top Layer w0.254: SPK1.2 87.55,53.21 90.55,53.21 91.37,52.39 U11.16
$1N6917: length 4.4
  Top Layer w0.254: C7.2 89.92,20.45 90.3,20.07 U12.3
$1N7212: length 7.3
  Top Layer w0.254: R13.2 39.5,24.26 40.03,24.78 U10.9
$1N7925: length 9.1
  Top Layer w0.254: X1.1 35.52,28.43 C20.2 40.5,28.46 41.18,27.78 U10.3
$1N7930: length 9.4
  Top Layer w0.254: X1.2 35.18,25.93 C21.2 40.02,26.31 41,27.28 U10.4
$1N8028: length 14.7
  Top Layer w0.254: U10.44 45.64,30.32 45.64,32.4 45.1,32.94 36.43,32.94 36.18,33.19 R22.1
$1N8104: length 1.8
  Top Layer w0.254: LED2.3 41.74,15.94 R23.1
$1N8256: length 39.6
  Top Layer w0.254: DS1.12 43.56,57.53 v1(43.56,56.13) ; Q1.3 v1(64.39,54.61)
  Bottom Layer w0.254: v1(64.39,54.61) 43.94,54.61 43.56,54.99 v1(43.56,56.13)
$1N8335: length 28.2
  Top Layer w0.254: DS1.9 51.18,57.53 v1(51.18,56.26) ; Q2.3 v1(60.65,55.37)
  Bottom Layer w0.254: v1(60.65,55.37) 51.56,55.37 51.18,55.75 v1(51.18,56.26)
$1N8343: length 6.4
  Top Layer w0.254: Q4.3 53.18,39.97 53.47,40.26 55.88,40.26 56.26,40.64 56.26,42.29 DS1.6
$1N8477: length 2.3
  Top Layer w0.254: 63.53,33.97 63.31,34.2 63.31,36.13
$1N8481: length 1.6
  Top Layer w0.254: 59.6,34.24 59.6,35.71 59.5,35.81
$1N8485: length 1.3
  Top Layer w0.254: 56.1,34.3 56.11,34.32 56.11,35.61
$1N8489: length 1.7
  Top Layer w0.254: 52.44,35.75 52.44,34.41 52.21,34.17
$1N8598: length 10.6
  Top Layer w0.254: C22.2 37.21,25.27 37.72,25.78 42.1,25.78 U10.7
$1N9384: length 6.5
  Top Layer w0.254: R28.2 C27.2 70.96,20.78 C25.2 73.08,20.81 73.16,20.74
$1N9794: length 56.3
  Top Layer w0.254: v1(54.99,15.11) 59.82,15.11 60.32,14.61 60.32,6.99 61.1,6.21 R32.1 ; v1(49.32,29) 49.1,29.21 U10.37
  Bottom Layer w0.254: v1(49.32,29) 53.04,29 54.99,27.05 v1(54.99,15.11)
$1N9795: length 2.4
  Top Layer w0.254: R32.2 83.31,1.89 H2.1
$1N9824: length 87.2
  Top Layer w0.254: v1(48.6,25.86) 48.6,27.33 49.05,27.78 U10.34 ; v1(48.9,19.92) 48.8,20.02 46.66,20.02 46.06,19.42 46.06,14.82 45.47,14.22 41.78,14.22 41.28,13.72 41.28,2.54 42.04,1.78 79.88,1.78 80.47,2.36 80.47,5.03 80.65,5.21 85.6,5.21 86.77,6.38 R33.1
  Bottom Layer w0.254: v1(48.6,25.86) 48.6,24.34 48.72,24.22 48.72,20.1 v1(48.9,19.92)
$1N9825: length 2.6
  Top Layer w0.254: R33.2 90.85,4.3 H2.4
$1N10132: length 9.4
  Top Layer w0.508: H3.1 19.18,56.77 18.67,56.26 BT1.1
$1N10135: length 45.1
  Top Layer w0.254: U10.1 42.88,28.78 43.05,28.96 43.05,31.25 42.17,32.13 28.83,32.13 27.94,33.02 27.94,53.72 27.43,54.23 H3.2
$2N394: length 7.3
  Top Layer w0.254: USB1.A5 7.39,25.14 5.34,25.14 4.94,25.54 R9.2
$2N397: length 7
  Top Layer w0.254: USB1.B5 5.36,22.12 4.94,21.7 R10.2
$2N1836: length 1.8
  Top Layer w0.254: R21.1 13.21,20.05 U3.9
$2N7002: length 5.5
  Top Layer w0.254: LED5.1 16.12,37.56 LED4.2 15.21,37.59 15.21,37.59 14.22,37.59 14.1,37.47 14.1,36.58
$2N7018: length 2.4
  Top Layer w0.254: R20.2 20.59,35.06 LED5.2
$2N7022: length 2.3
  Top Layer w0.254: R19.2 20.58,37.59 LED4.1
$2N7090: length 3.7
  Top Layer w0.254: 14.1,34.58 14.1,33.02 14.35,32.77 R18.2

## Copper pours and planes (outline as drawn; the poured copper is in the pictures)
+3V3 on Top Layer: 72.04,34.62 71.68,34.26 71.68,29.86 71.97,29.56 75.28,29.56 75.85,30.14 75.85,33.84 75.07,34.62
+3V3 on Top Layer: 11.41,44.48 11.29,44.35 11.29,39.88 11.6,39.56 16.15,39.56 16.65,40.07 16.65,43.92 16.09,44.48
+3V3 on Top Layer: 91.57,13 91.05,12.49 91.05,9.75 91.73,9.07 93.32,9.07 93.75,9.5 96.01,9.5 96.39,9.88 96.39,12.18 95.57,13
+3V3 on Top Layer: 10.12,23.35 10.07,23.3 10.07,22.28 10.31,22.04 11.58,22.04 11.9,22.37 11.9,23.27 11.82,23.35
GND on Top Layer: -0.43,61.76 102.81,61.76 102.81,-1.68 -0.43,-1.68
GND on Bottom Layer: -7.23,66.07 111.87,66.07 111.87,-6.94 -7.23,-6.94
VBAT on Top Layer: 4.03,42.05 3.37,41.39 2.66,41.39 2.66,38.25 3.15,37.76 5.77,37.76 6.65,36.89 8.44,36.89 8.91,36.42 8.91,35.62 12.51,35.62 12.82,35.93 12.82,37.3 12.41,37.71 11,37.71 10.37,38.34 10.37,38.8 10.15,39.02 9,39.02 8.81,39.21 8.81,41.54 8.3,42.05
VBUS on Top Layer: 12.28,35.37 11.85,35.37 11.68,35.05 11.68,30.29 12.29,29.68 14.85,29.68 15.22,30.05 15.22,31.75 14.79,32.18 13.52,32.18 13.17,32.53 13.17,34.9 12.7,35.37
VBUS on Top Layer: 11.93,22.41 11.81,22.29 11.81,21.14 12.04,20.92 12.84,20.92 12.93,21.01 12.93,22.28 12.79,22.41
+VS on Top Layer: 65.44,24.06 65.11,24.4 65.11,25.8 65.36,26.05 69.77,26.05 70.31,25.52 70.31,24.41 69.96,24.06

Small or netless copper shapes (teardrops, artwork), in the pictures only: 463 on Top Layer, 105 on Bottom Layer
